# EAGLE design AzoreanReflowController (EAGLE 8.6.0)
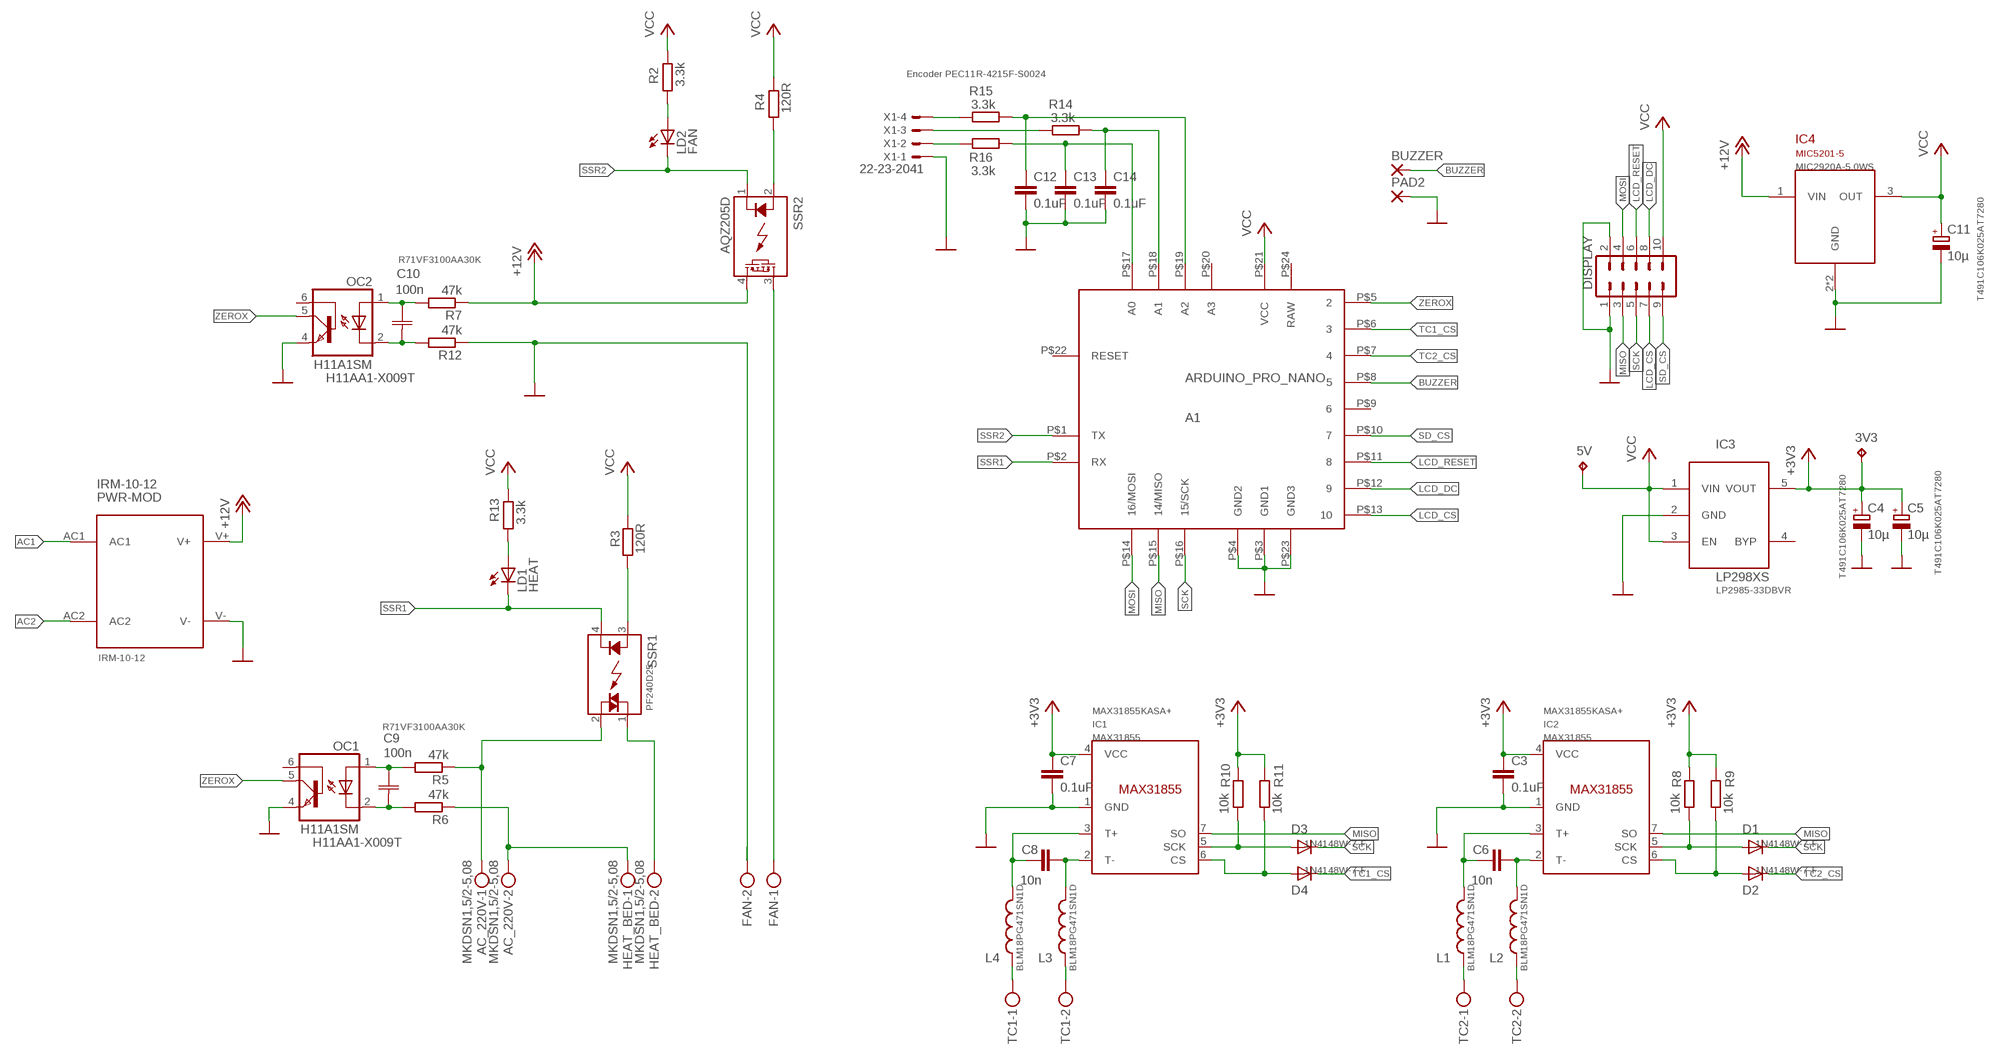
[diagram p0: schematic, sheet 1]

## Parts
3V3  TPTP08R  [TP08R]
5V  TPTP08R  [TP08R]
A1  ARDUINO_PRO_NANO  [ARDUINO_PRO_NANO]
AC_220V  MKDSN1,5/2-5,08  [MKDSN1,5/2-5,08]
BUZZER  1,6/0,8  [1,6/0,8]
C3  0.1uF  0.1UF-0603-25V-5%  [0603]
C4  10µ  CPOL-EUC/6032-28R  [C/6032-28R]
C5  10µ  CPOL-EUC/6032-28R  [C/6032-28R]
C6  10n  C-EUC0603  [C0603]
C7  0.1uF  0.1UF-0603-25V-5%  [0603]
C8  10n  C-EUC0603  [C0603]
C9  100n  R71VF  [R71V]
C10  100n  R71VF  [R71V]
C11  10µ  CPOL-EUC/6032-28R  [C/6032-28R]
C12  0.1uF  0.1UF-0603-25V-5%  [0603]
C13  0.1uF  0.1UF-0603-25V-5%  [0603]
C14  0.1uF  0.1UF-0603-25V-5%  [0603]
D1  DIODESOD-123  [SOD-123]
D2  DIODESOD-123  [SOD-123]
D3  DIODESOD-123  [SOD-123]
D4  DIODESOD-123  [SOD-123]
DISPLAY  M05X2SHD-NS  [2X5-SHROUDED-NS]
FAN  MKDSN1,5/2-5,08  [MKDSN1,5/2-5,08]
HEAT_BED  MKDSN1,5/2-5,08  [MKDSN1,5/2-5,08]
IC1  MAX31855  [SOIC8]
IC2  MAX31855  [SOIC8]
IC3  LP298XS  [SOT23-5L]
IC4  MIC5201-5  [SOT-223]
L1  INDUCTOR0603  [0603]
L2  INDUCTOR0603  [0603]
L3  INDUCTOR0603  [0603]
L4  INDUCTOR0603  [0603]
LD1  HEAT  LEDCHIP-LED0603  [CHIP-LED0603]
LD2  FAN  LEDCHIP-LED0603  [CHIP-LED0603]
OC1  H11A1SM  [DIL6-SMD]
OC2  H11A1SM  [DIL6-SMD]
PAD2  1,6/0,8  [1,6/0,8]
PWR-MOD  IRM-10-12  [IRM-10-12]
R2  3.3k  R-EU_R0603  [R0603]
R3  120R  R-EU_R0603  [R0603]
R4  120R  R-EU_R0603  [R0603]
R5  47k  R-EU_0207/5V  [0207/5V]
R6  47k  R-EU_0207/5V  [0207/5V]
R7  47k  R-EU_0207/5V  [0207/5V]
R8  10k  R-EU_R0603  [R0603]
R9  10k  R-EU_R0603  [R0603]
R10  10k  R-EU_R0603  [R0603]
R11  10k  R-EU_R0603  [R0603]
R12  47k  R-EU_0207/5V  [0207/5V]
R13  3.3k  R-EU_R0603  [R0603]
R14  3.3k  R-EU_R0603  [R0603]
R15  3.3k  R-EU_R0603  [R0603]
R16  3.3k  R-EU_R0603  [R0603]
SSR1  PF240D25  [PF240XX]
SSR2  AQZ205D  [AQZ-SIL04]
TC1  MKDSN1,5/2-5,08  [MKDSN1,5/2-5,08]
TC2  MKDSN1,5/2-5,08  [MKDSN1,5/2-5,08]
X1  22-23-2041  [22-23-2041]

## Nets
12V: IC4.1(VIN) PWR-MOD.V+ R7.1 SSR2.4(DS2) ; supply symbol labelled +12V
+3V3: 3V3.TP C3.1 C4.+ C5.+ C7.1 IC1.4(VCC) IC2.4(VCC) IC3.5(VOUT) R8.2 R9.2 R10.2 R11.2
AC1: AC_220V.1 PWR-MOD.AC1 R5.1 SSR1.2(ACL2)
AC2: AC_220V.2 HEAT_BED.1 PWR-MOD.AC2 R6.1
AC_OUT1: HEAT_BED.2 SSR1.1(ACL1)
BUZZER: A1.P$8 BUZZER.1(P)
FAN_OUT: FAN.1 SSR2.3(DS1)
GND: A1.P$3(GND1) A1.P$4(GND2) A1.P$23(GND3) C3.2 C4.- C5.- C7.2 C11.- C12.2 C13.2 C14.2 DISPLAY.1 DISPLAY.2 FAN.2 IC1.1(GND) IC2.1(GND) IC3.2(GND) IC4.2(GND) IC4.4(GND) OC1.4(EMI) OC2.4(EMI) PAD2.1(P) PWR-MOD.V- R12.1 X1.1
LCD_CS: A1.P$13 DISPLAY.7
LCD_DC: A1.P$12 DISPLAY.8
LCD_RESET: A1.P$11 DISPLAY.6
MISO: A1.P$15(14/MISO) DISPLAY.3 IC1.7(SO) IC2.7(SO)
MOSI: A1.P$14(16/MOSI) DISPLAY.4
N$1: C8.2 IC1.2(T-) L3.2
N$2: C6.2 IC2.2(T-) L2.2
N$3: C6.1 IC2.3(T+) L1.2
N$4: A1.P$17(A0) C13.1 R16.2
N$5: A1.P$18(A1) C14.1 R14.2
N$7: L1.1 TC2.1
N$8: A1.P$19(A2) C12.1 R15.2
N$9: C9.1 OC1.1(A) R5.2
N$10: C9.2 OC1.2(C) R6.2
N$11: C8.1 IC1.3(T+) L4.2
N$12: C10.1 OC2.1(A) R7.2
N$13: R3.2 SSR1.3(DC+)
N$14: R4.2 SSR2.2(A)
N$15: D2.A IC2.6(CS) R9.1
N$16: D1.A IC2.5(SCK) R8.1
N$17: D4.A IC1.6(CS) R11.1
N$18: D3.A IC1.5(SCK) R10.1
N$19: C10.2 OC2.2(C) R12.2
N$20: R16.1 X1.2
N$21: R14.1 X1.3
N$22: L4.1 TC1.1
N$23: L3.1 TC1.2
N$24: L2.1 TC2.2
N$25: LD2.A R2.2
N$26: R15.1 X1.4
N$27: LD1.A R13.2
SCK: A1.P$16(15/SCK) D1.C D3.C DISPLAY.5
SD_CS: A1.P$10 DISPLAY.9
SSR1: A1.P$2(RX) LD1.C SSR1.4(DC-)
SSR2: A1.P$1(TX) LD2.C SSR2.1(K)
TC1_CS: A1.P$6 D4.C
TC2_CS: A1.P$7 D2.C
VCC: 5V.TP A1.P$21(VCC) C11.+ DISPLAY.10 IC3.1(VIN) IC3.3(EN) IC4.3(OUT) R2.1 R3.1 R4.1 R13.1
ZEROX: A1.P$5 OC1.5(COL) OC2.5(COL)
Unconnected: A1.P$9 A1.P$20(A3) A1.P$22(RESET) IC3.4(BYP) OC1.6(BAS) OC2.6(BAS)

## Notes on the sheet
- NON-ISOLATED CIRCUIT
  HIGH VOLTAGE 100 to 240VAC
- ISOLATED CIRCUIT
  DIGITAL LOW VOLTAGE
- 100 to 240VAC
  50/60Hz
- Encoder PEC11R-4215F-S0024

## Power pins joined to a net without a drawn wire
RAW: A1.P$24(RAW)

## Library data of the parts
3V3 5V = testpad:TP: Test pad
A1 = pit:ARDUINO_PRO_NANO: SparkFun Arduino Pro Nano
AC_220V FAN HEAT_BED TC1 TC2 = con-phoenix-508:MKDSN1,5/2-5,08: MKDSN 1,5/ 2-5,08 Printklemme Nennstrom: 13,5 A Nennspannung: 250 V Rastermaß: 5,08 mm Polzahl: 2 Anschlussart: Schraubanschluss Montage: Löten Anschlussrichtung Leiter/Platine: 0 ° Artikelnummer: 1729128 Source: http://eshop.phoenixcontact.com .. 1729128.pdf; MPN: MKDSN 1,5/2-5.08; OC_FARNELL: 1792903; OC_NEWARK: 30M2397; REF: 1715721
BUZZER = wirepad:1,6/0,8: THROUGH-HOLE PAD; REF: 254-EMB140-RO
C3 C7 C12-C14 = SparkFun-Capacitors:0.1UF: 0.1µF ceramic capacitors A capacitor is a passive two-terminal electrical component used to store electrical energy temporarily in an electric field.; PROD_ID: CAP-08604; REF: VJ0603Y104JXJPW1BC
C4 C5 C11 = rcl:CPOL-EU: POLARIZED CAPACITOR, European symbol; REF: T491C106K025AT7280
C6 = rcl:C-EU: CAPACITOR, European symbol
C8 = rcl:C-EU: CAPACITOR, European symbol; REF: C0603C103K4RACTM
C9 C10 = Kemet_By_element14_Batch_1:R71VF; REF: R71VF3100AA30K
D1-D4 = adafruit:DIODE: Diode SMADIODE - SMA Surface Mount Package 20V 1A Schottky Diode Digikey: 641-1014-6-ND DO-1N4148 - Through Hole Small Current Diode SOD-123 20V 1 A (.5mV Vf) Schottky Diode - Digikey: MBRX120TPMSCT-ND SOD-323 10V 570mA (.38mV Vf, 3ns) Schottky Diode - Digikey: ZLLS410CT-ND SOD-523 30V 30mA Schottky Diode (RB751S-40TE61) - Digikey: RB751S-40TE61CT-ND SOT23-R/W - SOT23 Package (R = Solder Paste/Reflow Ovens, W = Hand-Soldering) BAT54Film 40V 300mA - Digikey: 497-7162-1-ND; REF: 1N4148W-7-F
DISPLAY = SparkFun-Connectors:M05X2: Header 5x2 Standard 10-pin dual row 0.1" header. Commonly used with AVR-ISP. Use with Spark Fun Electronics SKU: PRT-00778
IC1 IC2 = AlexW-Eagle-Libraries:MAX31855; REF: MAX31855KASA+
IC3 = adafruit:LP298X; REF: LP2985-33DBVR
IC4 = micrel:MIC5201-5: Micrel MIC5201 200mA Low-Dropout Regulator General Description The MIC5201 is an efficient linear voltage regulator with very low dropout voltage (typically 17mV at light loads and 200mV at 100mA), and very low ground current (1mA at 100mA output), offering better than 1% initial accuracy with a logic compatible on-off switching input. Designed especially for hand-held battery powered devices, the MIC5201 can be switched by a CMOS or TTL compatible enable signal. This enable control may be connected directly to VIN if unneeded. When disabled, power consumption drops nearly to zero. The ground current of the MIC5201 increases only slightly in dropout, further prolonging battery life. Key MIC5201 features include current limiting, overtemperature shutdown, and protection against reversed battery. The MIC5201 is available in several fixed voltages and accuracy configurations. It features the same pinout as the LT1121 with better performance. Other options are available; contact Micrel for details. Features High output voltage accuracy Variety of output voltages Guaranteed 200mA output Low quiescent current Low dropout voltage Extremely tight load and line regulation Very low temperature coefficient Current and thermal limiting Reversed-battery protection Load-dump protection (fixed voltage versions) Zero off-mode current Logic-controlled electronic enable Available in SO-8 and SOT-223 packages; REF: MIC2920A-5.0WS
L1-L4 = SparkFun-Passives:INDUCTOR: Inductors Basic Inductor/Choke - 0603 and 1206. Footprints are not proven and vary greatly between part numbers. INDUCTOR POWER 3.3UH 4.0A SMD 0.197" L x 0.197" W x 0.177" H (5.00mm x 5.00mm x 4.50mm); REF: BLM18PG471SN1D
LD1 LD2 = led:LED: LED OSRAM: - CHIPLED LG R971, LG N971, LY N971, LG Q971, LY Q971, LO R971, LY R971 LH N974, LH R974 LS Q976, LO Q976, LY Q976 LO Q996 - Hyper CHIPLED LW Q18S LB Q993, LB Q99A, LB R99A - SideLED LS A670, LO A670, LY A670, LG A670, LP A670 LB A673, LV A673, LT A673, LW A673 LH A674 LY A675 LS A676, LA A676, LO A676, LY A676, LW A676 LS A679, LY A679, LG A679 - Hyper Micro SIDELED® LS Y876, LA Y876, LO Y876, LY Y876 LT Y87S - SmartLED LW L88C, LW L88S LB L89C, LB L89S, LG L890 LS L89K, LO L89K, LY L89K LS L896, LA L896, LO L896, LY L896 - TOPLED LS T670, LO T670, LY T670, LG T670, LP T670 LSG T670, LSP T670, LSY T670, LOP T670, LYG T670 LG T671, LOG T671, LSG T671 LB T673, LV T673, LT T673, LW T673 LH T674 LS T676, LA T676, LO T676, LY T676, LB T676, LH T676, LSB T676, LW T676 LB T67C, LV T67C, LT T67C, LS T67K, LO T67K, LY T67K, LW E67C LS E67B, LA E67B, LO E67B, LY E67B, LB E67C, LV E67C, LT E67C LW T67C LS T679, LY T679, LG T679 LS T770, LO T770, LY T770, LG T770, LP T770 LB T773, LV T773, LT T773, LW T773 LH T774 LS E675, LA E675, LY E675, LS T675 LS T776, LA T776, LO T776, LY T776, LB T776 LHGB T686 LT T68C, LB T68C - Hyper Mini TOPLED® LB M676 - Mini TOPLED Santana® LG M470 LS M47K, LO M47K, LY M47K Source: http://www.osram.convergy.de LUXEON: - LUMILED® LXK2-PW12-R00, LXK2-PW12-S00, LXK2-PW14-U00, LXK2-PW14-V00 LXK2-PM12-R00, LXK2-PM12-S00, LXK2-PM14-U00 LXK2-PE12-Q00, LXK2-PE12-R00, LXK2-PE12-S00, LXK2-PE14-T00, LXK2-PE14-U00 LXK2-PB12-K00, LXK2-PB12-L00, LXK2-PB12-M00, LXK2-PB14-N00, LXK2-PB14-P00, LXK2-PB14-Q00 LXK2-PR12-L00, LXK2-PR12-M00, LXK2-PR14-Q00, LXK2-PR14-R00 LXK2-PD12-Q00, LXK2-PD12-R00, LXK2-PD12-S00 LXK2-PH12-R00, LXK2-PH12-S00 LXK2-PL12-P00, LXK2-PL12-Q00, LXK2-PL12-R00 Source: www.luxeon.com KINGBRIGHT: KA-3528ASYC Source: www.kingbright.com
OC1 OC2 = optocoupler:H11A*?M: General Purpose 6-Pin Phototransistor Optocouplers Source: http://www.fairchildsemi.com/ds/4N/4N35-M.pdf; OC_FARNELL: unknown; OC_NEWARK: unknown; REF: H11AA1-X009T
PAD2 = wirepad:1,6/0,8: THROUGH-HOLE PAD
PWR-MOD = MeanWellDirect:IRM-10-12: Power Supply IRM-10-12 Universal AC input / full range Compact size Protection : Short circuit / Overload / Over Voltage Cooling by free air convection Isolation class II No load power consumption < 0.1W 100% full load burn-in test High reliability 3 year warranty; REF: IRM-10-12
R2 R13-R16 = rcl:R-EU_: RESISTOR, European symbol; REF: RC0603FR-073K3L
R3 R4 = rcl:R-EU_: RESISTOR, European symbol; REF: RC0603FR-07120RL
R5-R7 R12 = rcl:R-EU_: RESISTOR, European symbol; REF: 273-47K-RC
R8-R11 = rcl:R-EU_: RESISTOR, European symbol
SSR1 = Crydom-SSR:PF240D25: PF Series • SIP SSR • Ratings to 25A (forced air) @ 480 VAC • SCR output for heavy industrial loads • AC or DC control • Zero-crossing (resistive loads) or random-fire (inductive loads) output; REF: PF240D25
SSR2 = relay:AQZ20*D: PhotoMOS Relay NAiS Source: http://www.panasonic-electric-works.com/catalogues/downloads/photomos/ds_x615_en_aqz10_20.pdf; MF: AROMAT/ MATSUSHITA; MPN: AQZ205D; OC_FARNELL: 1175736; OC_NEWARK: 10C4047; REF: AQZ205; SPICEPREFIX: K
X1 = con-molex:22-23-2041: .100" (2.54mm) Center Header - 4 Pin; MF: MOLEX; MPN: 22-23-2041; OC_FARNELL: 1462920; OC_NEWARK: 38C0355

## Board
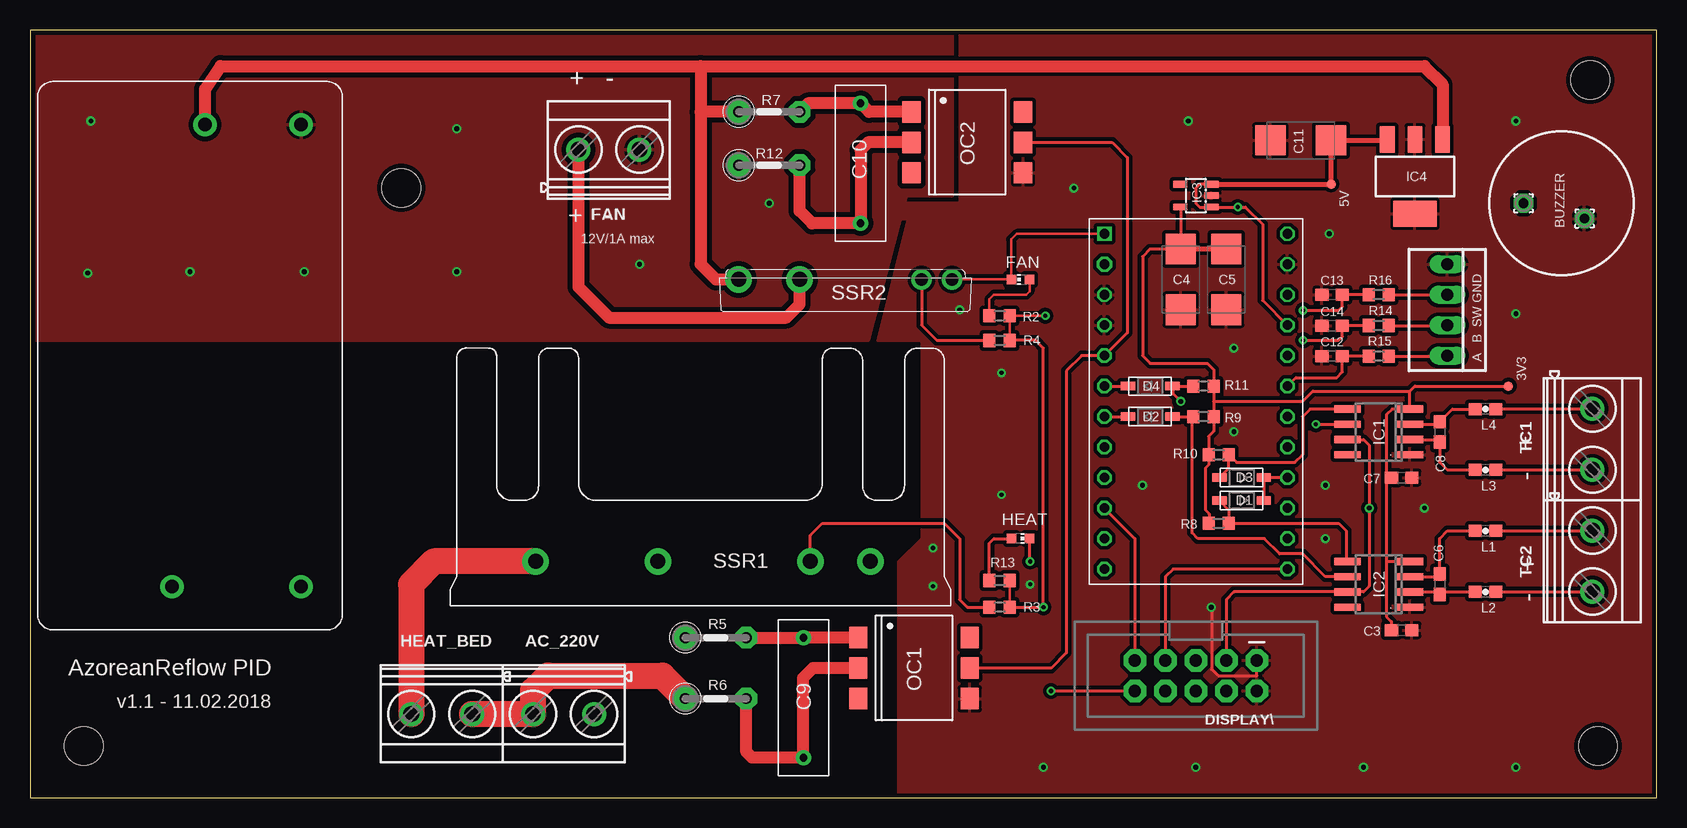
[diagram p1: board, top side]
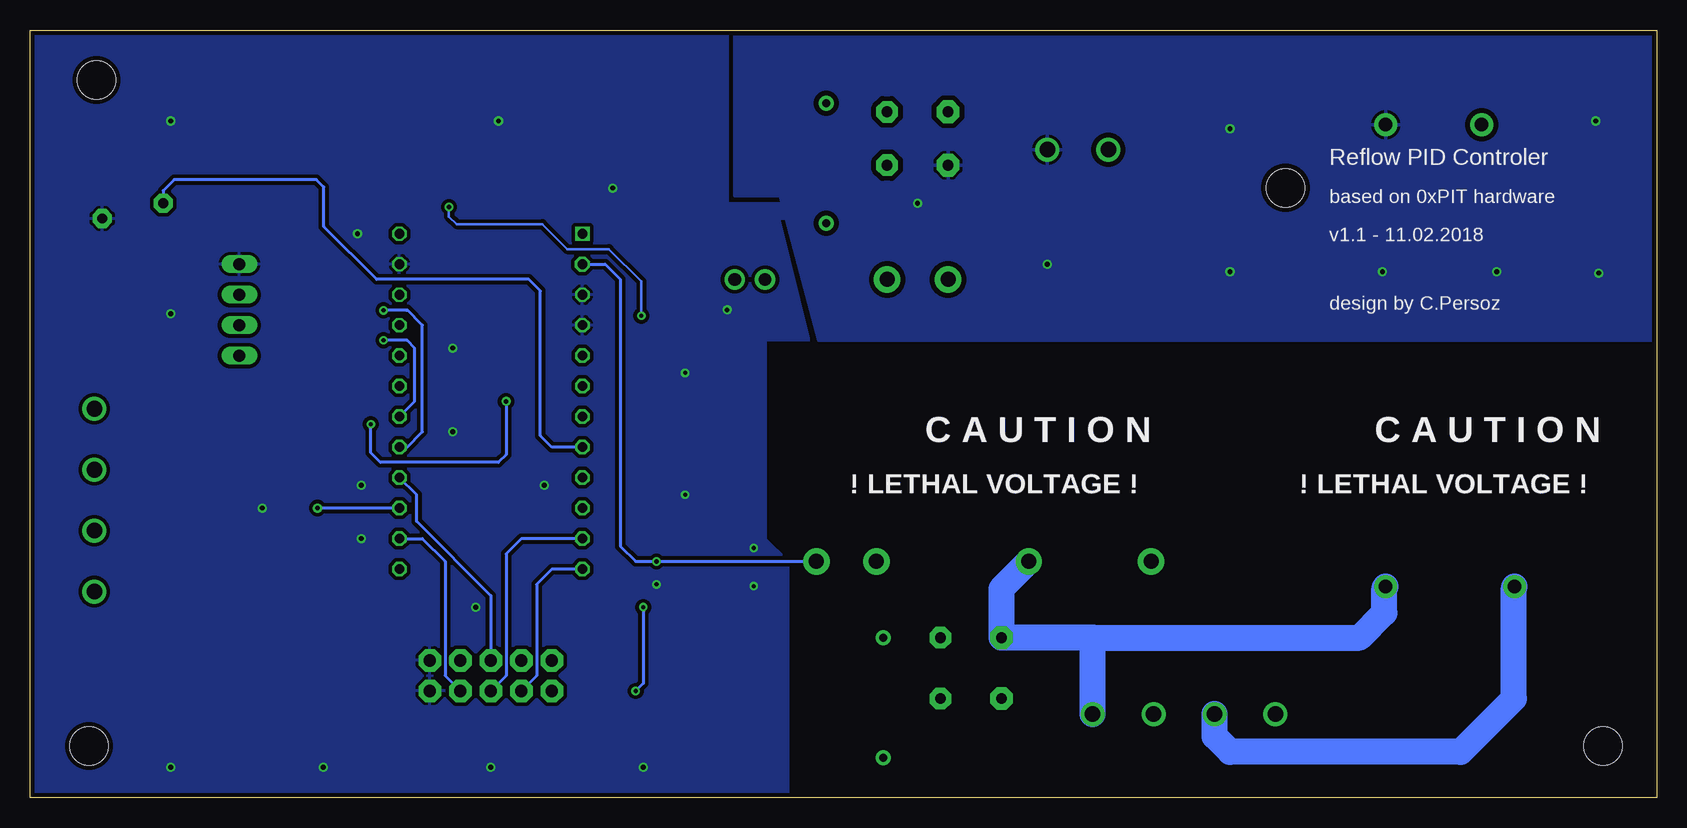
[diagram p2: board, bottom side, seen from below]

Size 135.56 x 63.97 mm. Coordinates in mm from the lower left corner, seen from the top.
Outline: 0,0 135.56,0 135.56,63.97 0,63.97 0,0
Copper layers (1*16): Top 0.0356mm / dielectric 1.5011mm / Bottom 0.0356mm
Design rules "OSHPark-2layer": minimum track width 6mil, minimum drill 13mil, track to track 6mil, track to pad 6mil, pad to pad 6mil, via to via 6mil, smd to smd 6mil, copper to edge 15mil, drill to drill 6mil, minimum pad ring 7mil, minimum via ring 7mil, stop-mask expansion 2.5mil, vias tented up to drill 0mil, thermal gap 10mil
Holes 3.2 mm at 4.48,4.31 130.66,4.31 30.94,50.81 130.02,59.81

### Footprints (pad centres in the part's own frame; a part is rotated, then mirrored left to right if it is on the bottom)
TP08R = smd 0.8 x 0.8: TP 0,0
ARDUINO_PRO_NANO = drill 0.8 square: P$1 -7.62,13.97 | drill 0.8 pad 1.27 octagon: P$2 -7.62,11.43 | drill 0.8 octagon: P$3 -7.62,8.89; P$4 -7.62,6.35; P$5 -7.62,3.81; P$6 -7.62,1.27; P$7 -7.62,-1.27; P$8 -7.62,-3.81; P$9 -7.62,-6.35; P$10 -7.62,-8.89; P$11 -7.62,-11.43; P$12 -7.62,-13.97; P$13 7.62,-13.97; P$14 7.62,-11.43; P$15 7.62,-8.89; P$16 7.62,-6.35; P$17 7.62,-3.81; P$18 7.62,-1.27; P$19 7.62,1.27; P$20 7.62,3.81; P$21 7.62,6.35; P$22 7.62,8.89; P$23 7.62,11.43; P$24 7.62,13.97
MKDSN1,5/2-5,08 = drill 1.3 pad 2: 1 -2.561,0.025; 2 2.519,0.025
1,6/0,8 = drill 0.813 pad 1.6 octagon: 1 0,0
0603 = smd 1.1 x 1: 1 -0.85,0; 2 0.85,0
C/6032-28R = smd 2.55 x 2.5: + 2.525,0; - -2.525,0
C0603 = smd 1.1 x 1: 1 -0.85,0; 2 0.85,0
R71V = drill 0.65 pad 1.27: 1 -5,0; 2 5,0
SOD-123 = smd 1.2 x 0.7: A 1.85,0; C -1.85,0
2X5-SHROUDED-NS = drill 1.016 pad 1.88 octagon: 1 -1.27,5.08; 2 1.27,5.08; 3 -1.27,2.54; 4 1.27,2.54; 5 -1.27,0; 6 1.27,0; 7 -1.27,-2.54; 8 1.27,-2.54; 9 -1.27,-5.08; 10 1.27,-5.08
SOIC8 = smd 0.6 x 2.2: 1 -1.905,-2.6; 2 -0.635,-2.6; 3 0.635,-2.6; 4 1.905,-2.6; 5 1.905,2.6; 6 0.635,2.6; 7 -0.635,2.6; 8 -1.905,2.6
SOT23-5L = smd 0.55 x 1.2: 1 -0.95,-1.3; 2 0,-1.3; 3 0.95,-1.3; 4 0.95,1.3; 5 -0.95,1.3
SOT-223 = smd 1.219 x 2.235: 1 -2.311,-3.099; 2 0,-3.099; 3 2.311,-3.099 | smd 3.6 x 2.2: 4 0,3.099
CHIP-LED0603 = smd 0.8 x 0.8: A 0,-0.75; C 0,0.75
DIL6-SMD = smd 1.78 x 1.52: 1 -2.54,-4.645; 2 0,-4.645; 3 2.54,-4.645; 4 2.54,4.645; 5 0,4.645; 6 -2.54,4.645
IRM-10-12 = drill 1.12 pad 1.93: AC1 19.25,9.25; AC2 19.25,-1.5; V+ -19.25,1.25; V- -19.25,9.25
R0603 = smd 1 x 1.1: 1 -0.85,0; 2 0.85,0
0207/5V = drill 0.9 pad 1.9 octagon: 1 -2.54,0 | drill 0.9 pad 1.8 octagon: 2 2.54,0
PF240XX = drill 1.25 pad 2.2: 1 -13.75,0; 2 -3.55,0; 3 9.15,0; 4 14.15,0
AQZ-SIL04 = drill 1.05 pad 1.7: 1 -8.89,0; 2 -6.35,0 | drill 1.25 pad 2.2: 3 3.81,0; 4 8.89,0
22-23-2041 = drill 1 long: 1 -3.81,0; 2 -1.27,0; 3 1.27,0; 4 3.81,0

### Placement (x,y rotation side)
3V3  123.19,34.29 0 top
5V  108.43,51.12 0 top
A1  97.16,33.02 0 top
AC_220V  44.45,6.99 180 top
BUZZER  124.46,49.53 90 top
C3  114.3,13.97 0 top
C4  95.89,43.18 90 top
C5  99.69,43.18 90 top
C6  117.47,17.78 270 top
C7  114.3,26.67 0 top
C8  117.47,30.48 270 top
C9  64.46,8.33 270 top
C10  69.22,52.86 270 top
C11  105.89,54.77 0 top
C12  108.51,36.8 180 top
C13  108.51,41.91 180 top
C14  108.51,39.31 180 top
D1  100.97,24.77 180 top
D2  93.34,31.75 0 top
D3  100.97,26.67 180 top
D4  93.34,34.29 0 top
DISPLAY  97.16,10.16 270 top
FAN  48.26,53.98 0 top
HEAT_BED  34.29,6.99 180 top
IC1  112.39,30.48 90 top
IC2  112.39,17.78 90 top
IC3  97.16,50.16 90 top
IC4  115.41,51.75 180 top
L1  121.28,22.23 180 top
L2  121.28,17.14 180 top
L3  121.28,27.3 180 top
L4  121.28,32.38 180 top
LD1  82.55,21.59 270 top
LD2  82.55,43.18 90 top
OC1  73.66,10.79 270 top
OC2  78.11,54.61 270 top
PAD2  129.54,48.26 90 top
PWR-MOD  13.34,36.83 270 top
R2  80.8,40.16 180 top
R3  80.8,15.88 180 top
R4  80.8,38.1 180 top
R5  57.15,13.34 0 top
R6  57.15,8.26 0 top
R7  61.59,57.15 0 top
R8  99.06,22.86 180 top
R9  97.79,31.75 0 top
R10  99.06,28.57 180 top
R11  97.79,34.29 0 top
R12  61.59,52.7 0 top
R13  80.8,18.09 180 top
R14  112.39,39.34 180 top
R15  112.39,36.79 180 top
R16  112.39,41.91 180 top
SSR1  55.88,19.68 0 top
SSR2  67.94,43.18 180 top
TC1  130.18,29.84 270 top
TC2  130.18,19.68 270 top
X1  118.11,40.64 270 top

### Tracks (layer width: path | path; a pad name or v marks a point on that pad's centre or on a via)
12V
  Top 1.016: SSR2.4 57.15,43.18 55.88,44.45 55.88,57.15 | 55.88,60.96 116.2,60.96 117.72,59.44 IC4.1 | 55.88,60.96 55.88,57.15 | R7.1 55.88,57.15 | PWR-MOD.V+ 14.59,59.03 15.88,60.96 55.88,60.96
+3V3
  Top 0.254: 115,33.87 IC1.4 113.51,32.38 113.03,31.91 113.03,27.09 C7.1 113.03,26.25 113.03,19.68 | 115,33.87 115.41,34.29 3V3.TP | 113.03,19.68 IC2.4 | 113.03,19.68 113.03,15.08 113.45,14.66 C3.1 | 98.64,33.02 R11.2 98.64,35.66 98.11,36.2 93.34,36.2 92.71,36.83 92.71,45.09 93.33,45.7 C4.+ 95.89,49.19 IC3.5 | 98.64,33.02 R9.2 98.64,30.54 98.21,30.11 R10.2 98.21,27.73 97.95,27.46 97.95,23.97 98.27,23.65 98.27,22.92 R8.2 | 98.64,33.02 106.05,33.02 106.9,33.87 115,33.87
  Top 0.406: C5.+ C4.+
AC1
  Bottom 2.184: AC_220V.1 47.01,12.09 46.99,13.34 | 46.99,13.34 R5.1 54.61,17.41 SSR1.2 | 46.99,13.34 24.77,13.34 22.7,15.4 22.7,17.46 PWR-MOD.AC1
AC2
  Top 2.184: R6.1 52.7,10.16 43.18,10.16 41.93,8.91 AC_220V.2 HEAT_BED.1
  Bottom 2.184: PWR-MOD.AC2 11.91,17.51 11.91,8.26 16.35,3.81 35.56,3.81 36.85,5.1 HEAT_BED.1
AC_OUT1
  Top 2.184: SSR1.1 33.66,19.68 31.75,17.78 31.77,17.76 HEAT_BED.2
BUZZER
  Bottom 0.254: A1.P$8 92.08,29.21 93.03,30.16 93.03,42.23 93.98,43.18 106.68,43.18 111.08,47.58 111.08,50.87 111.7,51.49 123.55,51.49 124.46,50.59 BUZZER.1
FAN_OUT
  Top 1.016: FAN.1 45.7,42.57 48.26,40.01 63.02,40.01 64.14,41.12 SSR2.3
GND  (via drill 0.35, 0.4 pad 0.61)
  Top 0.254: v98.42,15.88 98.48,15.82 98.48,10.69 99.03,10.16 102.23,10.16 DISPLAY.1
  other vias: 123.83,2.54 116.2,24.13 87,50.8 100.33,37.47 123.83,40.32 107.95,21.59 107.95,26.04 100.33,30.48 84.45,2.54 97.16,2.54 111.12,2.54 123.83,56.39 92.71,26.04 108.27,46.99 96.52,56.39 35.56,55.75 61.59,49.53 50.8,44.45 35.56,43.81 77.47,40.64 75.25,17.62 80.96,35.4 75.25,20.8 80.96,25.24 22.86,43.81 13.34,43.81 83.34,17.78 4.82,43.72 5.08,56.39
  pour Bottom (isolate 0.305): 77.47,64.14 77.47,49.53 72.21,49.53 71.57,48.26 73.18,48.26 70.64,38.1 74.3,38.1 74.3,0 135.25,0 135.25,64.14
  pour Top (isolate 0.305): 77.47,64.14 77.47,49.53 72.07,49.53 71.6,48.1 73.18,48.26 70.64,38.1 74.3,38.1 74.3,0 135.25,0 135.25,64.14
  pour Bottom (isolate 0.305): 72.39,0 72.39,19.68 74.3,21.59 88.27,21.59 88.27,0
  pour Top (isolate 0.305): 72.39,0 72.39,19.68 74.3,21.59 88.27,21.59 88.27,0
  pour Top (isolate 0.406): 76.83,64.14 76.83,50.16 73.03,50.16 69.85,38.1 0,38.1 0,64.14
  pour Bottom (isolate 0.406): 76.83,64.14 76.83,50.16 73.03,50.16 69.85,38.1 0,38.1 0,64.14
LCD_CS
  Top 0.254: A1.P$13 95.25,19.05 94.61,18.41 DISPLAY.7
LCD_DC
  Bottom 0.254: A1.P$12 92.08,19.05 93.34,17.78 93.34,10.16 DISPLAY.8
LCD_RESET
  Bottom 0.254: A1.P$11 94.61,21.59 95.89,20.32 95.89,10.16 DISPLAY.6
MISO  (via drill 0.4 pad 0.61)
  Top 0.254: IC1.7 111.12,29.84 111.6,29.37 v111.6,24.13 111.6,17.62 111.12,17.14 IC2.7 100.33,17.14 99.69,16.51 DISPLAY.3
  Bottom 0.254: A1.P$15 v111.6,24.13
MOSI
  Bottom 0.254: A1.P$14 102.87,21.59 100.97,19.68 100.97,10.16 DISPLAY.4
N$1
  Top 0.254: C8.2 117.47,29.53 | 117.47,29.53 117.47,27.94 118.11,27.3 L3.2 | IC1.2 117.16,29.84 117.47,29.53
  Top 0.406: 117.26,29.84 C8.2
N$2
  Top 0.254: C6.2 117.69,17.14 L2.2 | IC2.2 117.26,17.14
  Top 0.406: 117.26,17.14 C6.2 117.71,17.17
N$3
  Top 0.254: C6.1 117.47,21.59 118.11,22.23 L1.2 | IC2.3 117.26,18.41
  Top 0.406: 117.26,18.41 C6.1
N$4  (via drill 0.35)
  Top 0.254: R16.2 C13.1 109.36,40.93 109.37,40.92 109.06,40.6 v106.1,40.6
  Bottom 0.254: A1.P$17 104.14,29.21 102.87,30.48 102.87,39.37 104.14,40.64 104.17,40.6 v106.1,40.6
N$5  (via drill 0.35)
  Top 0.254: R14.2 109.4,39.34 C14.1 | C14.1 | v106.1,38.12 109.06,38.12 109.37,38.43 C14.1
  Bottom 0.254: A1.P$18 103.5,33.02 103.5,37.47 104.14,38.1 106.09,38.1 v106.1,38.12
N$7
  Top 0.254: L1.1 121.52,22.25 TC2.1
N$8
  Top 0.254: R15.2 C12.1 | C12.1 | A1.P$19 105.49,35 108.9,35 109.37,35.47 109.36,35.48 C12.1
N$9
  Top 1.016: OC1.1 C9.1 R5.2
N$10
  Top 1.016: OC1.2 65.25,10.79 64.41,9.96 64.41,3.44 C9.2 60.17,3.33 59.69,3.81 R6.2
N$11
  Top 0.254: C8.1 118.53,32.38 L4.2 | IC1.3 117.26,31.11
  Top 0.406: 117.26,31.11 C8.1
N$12
  Top 1.016: OC2.1 69.93,57.15 C10.1 64.85,57.86 R7.2
N$13
  Top 0.254: SSR1.3 65.03,21.85 66.04,22.86 76.2,22.86 77.47,21.59 77.47,16.51 78.11,15.88 R3.2
N$14
  Top 0.254: SSR2.2 74.3,39.37 75.56,38.1 R4.2
N$15
  Top 0.254: D2.A R9.1 96.84,31.65 96.84,22.07 97.31,21.59 102.87,21.59 104.14,20.32 106.05,20.32 107.95,18.41 IC2.6
N$16
  Top 0.254: D1.A 99.91,23.97 R8.1 109.06,22.86 109.7,22.23 109.7,19.78 IC2.5
  Top 0.406: 109.86,19.75 IC2.5
N$17  (via drill 0.35, 0.4 pad 0.61)
  Top 0.254: D4.A 95.25,34.29 | 95.25,34.29 R11.1 | v95.89,33.02 95.25,33.66 95.25,34.29 | v107.16,31.11 IC1.6
  Bottom 0.254: v95.89,33.02 95.89,28.57 96.52,27.94 106.36,27.94 107.16,28.73 v107.16,31.11
N$18
  Top 0.254: D3.A 99.91,27.46 R10.1 100.55,27.94 105.41,27.94 106.05,28.57 106.05,31.75 106.68,32.38 IC1.5
N$19
  Top 1.016: OC2.2 69.85,54.61 69.22,53.98 C10.2 65.17,47.86 64.14,48.9 R12.2
N$20
  Top 0.254: R16.1 X1.2
N$21
  Top 0.254: R14.1 118.08,39.34 X1.3
N$22
  Top 0.254: L4.1 121.52,32.41 TC1.1
N$23
  Top 0.254: L3.1 130.18,27.3 TC1.2
N$24
  Top 0.254: L2.1 121.52,17.17 TC2.2
N$25
  Top 0.203: 83.4,43.08 LD2.A 83.3,42.18 83.03,41.91 80.33,41.91 79.95,41.54 R2.2
N$26
  Top 0.254: R15.1 118.07,36.79 X1.4
N$27
  Top 0.254: R13.2 79.95,21.22 80.33,21.59 LD1.A
SCK
  Top 0.254: A1.P$16 D3.C D1.C
  Bottom 0.254: A1.P$16 103.35,25.24 103.35,23.02 97.16,16.83 DISPLAY.5
SD_CS
  Top 0.254: A1.P$10 92.08,21.59 DISPLAY.9
SSR1  (via drill 0.35)
  Top 0.254: v83.34,19.68 83.3,19.73 LD1.C
  Bottom 0.254: A1.P$2 87.63,44.45 86.36,43.18 86.36,20.95 85.09,19.68 v83.34,19.68 SSR1.4
SSR2
  Top 0.203: LD2.C 81.76,43.18 | 81.76,43.18 SSR2.1 | A1.P$1 82.23,46.99 81.76,46.51 81.76,43.18
TC1_CS
  Top 0.254: A1.P$6 D4.C
TC2_CS
  Top 0.254: A1.P$7 D2.C
VCC  (via drill 0.35)
  Top 0.203: R4.1 R2.1 v84.61,40.16 | R13.1 R3.1
  Top 0.254: IC3.3 97.47,51.12 97.16,50.8 97.16,49.53 97.47,49.22 IC3.1 v100.64,49.22 v100.65,49.21 101.28,49.21 102.71,47.78 102.71,41.43 A1.P$21 | R3.1 v84.45,15.88 84.45,37.47 83.82,38.1 R4.1 | v85.09,8.89 DISPLAY.10
  Top 0.406: 108.41,51.13 C11.+ 113.02,54.77 IC4.3 | 108.41,51.13 5V.TP | IC3.1 | IC3.3 108.39,51.12 108.41,51.13
  Bottom 0.203: v100.65,49.21 100.65,48.42 100.01,47.78 92.87,47.78 90.81,45.72 87.31,45.72 84.61,43.02 v84.61,40.16
  Bottom 0.254: v84.45,15.88 84.45,9.53 v85.09,8.89
ZEROX
  Top 0.254: OC2.5 90.17,54.61 91.44,53.34 91.44,38.73 A1.P$5 87.63,36.83 86.36,35.56 86.36,12.06 85.09,10.79 OC1.5

### Text on the board
tNames: + - | + - | 12V/1A max | FAN | A B SW GND | . | - + | HEAT | . | - + | AzoreanReflow PID | v1.1 - 11.02.2018 | DISPLAY\
bNames: Reflow PID Controler | based on 0xPIT hardware | v1.1 - 11.02.2018 | design by C.Persoz | C A U T I O N | C A U T I O N | ! LETHAL VOLTAGE ! | ! LETHAL VOLTAGE !